# Altium project Main_Board_Diseño.PrjPcb (part 1 of 3)
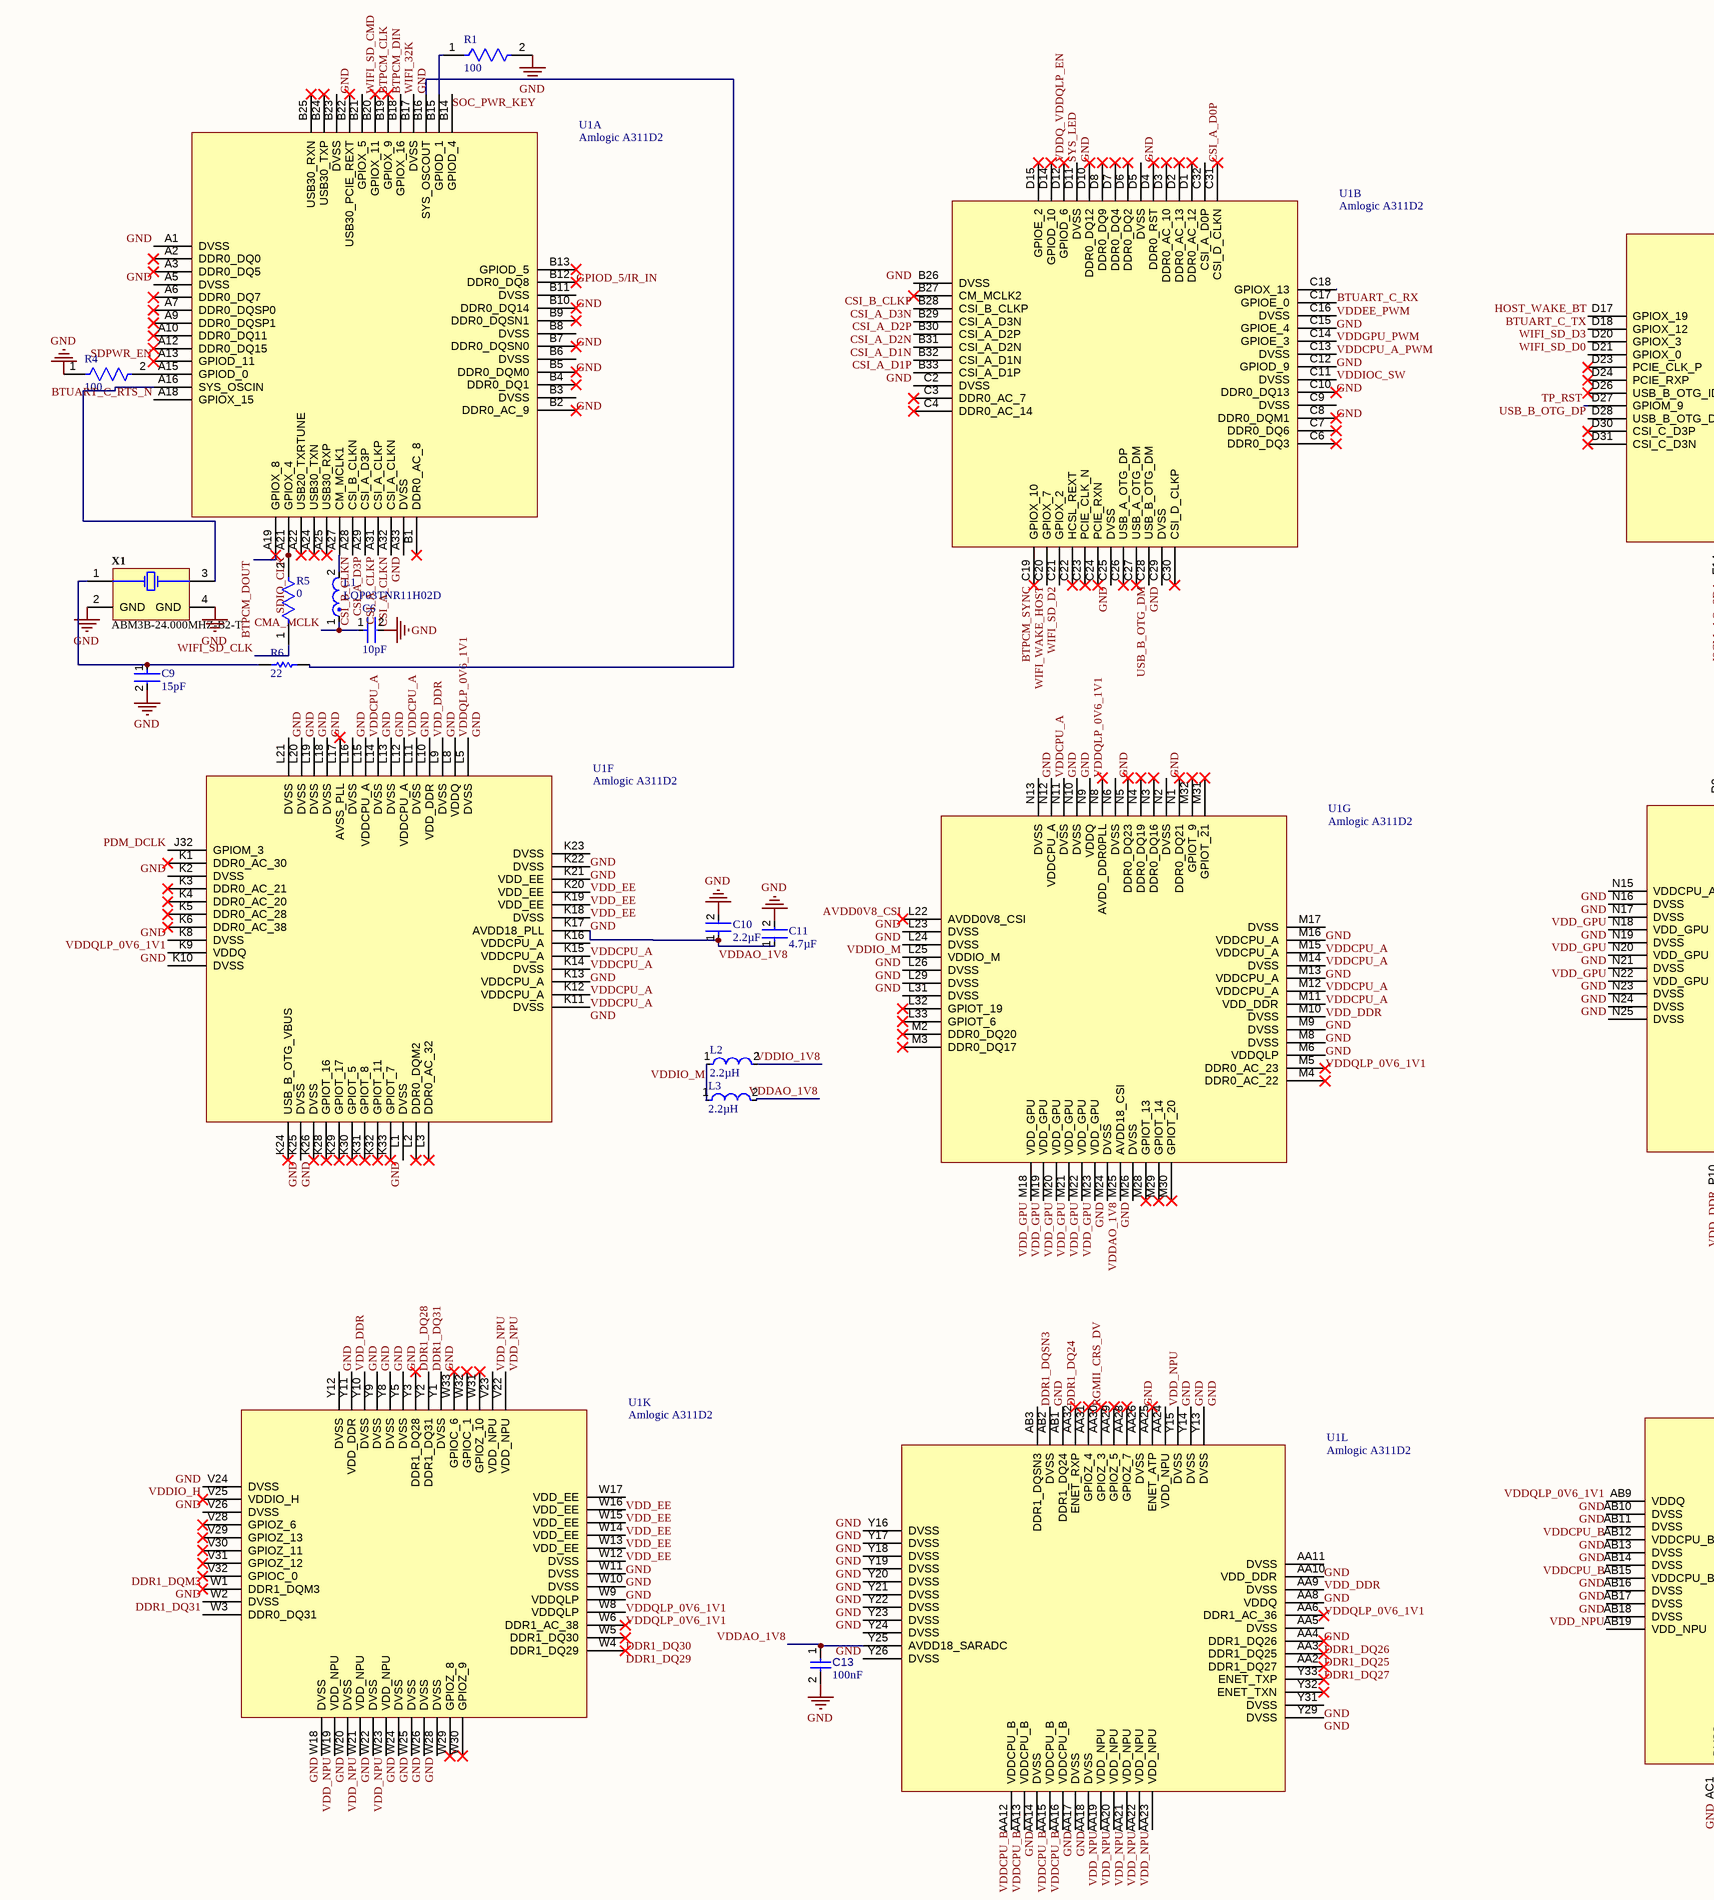
[diagram p0: Main_Board.SchDoc, top left]
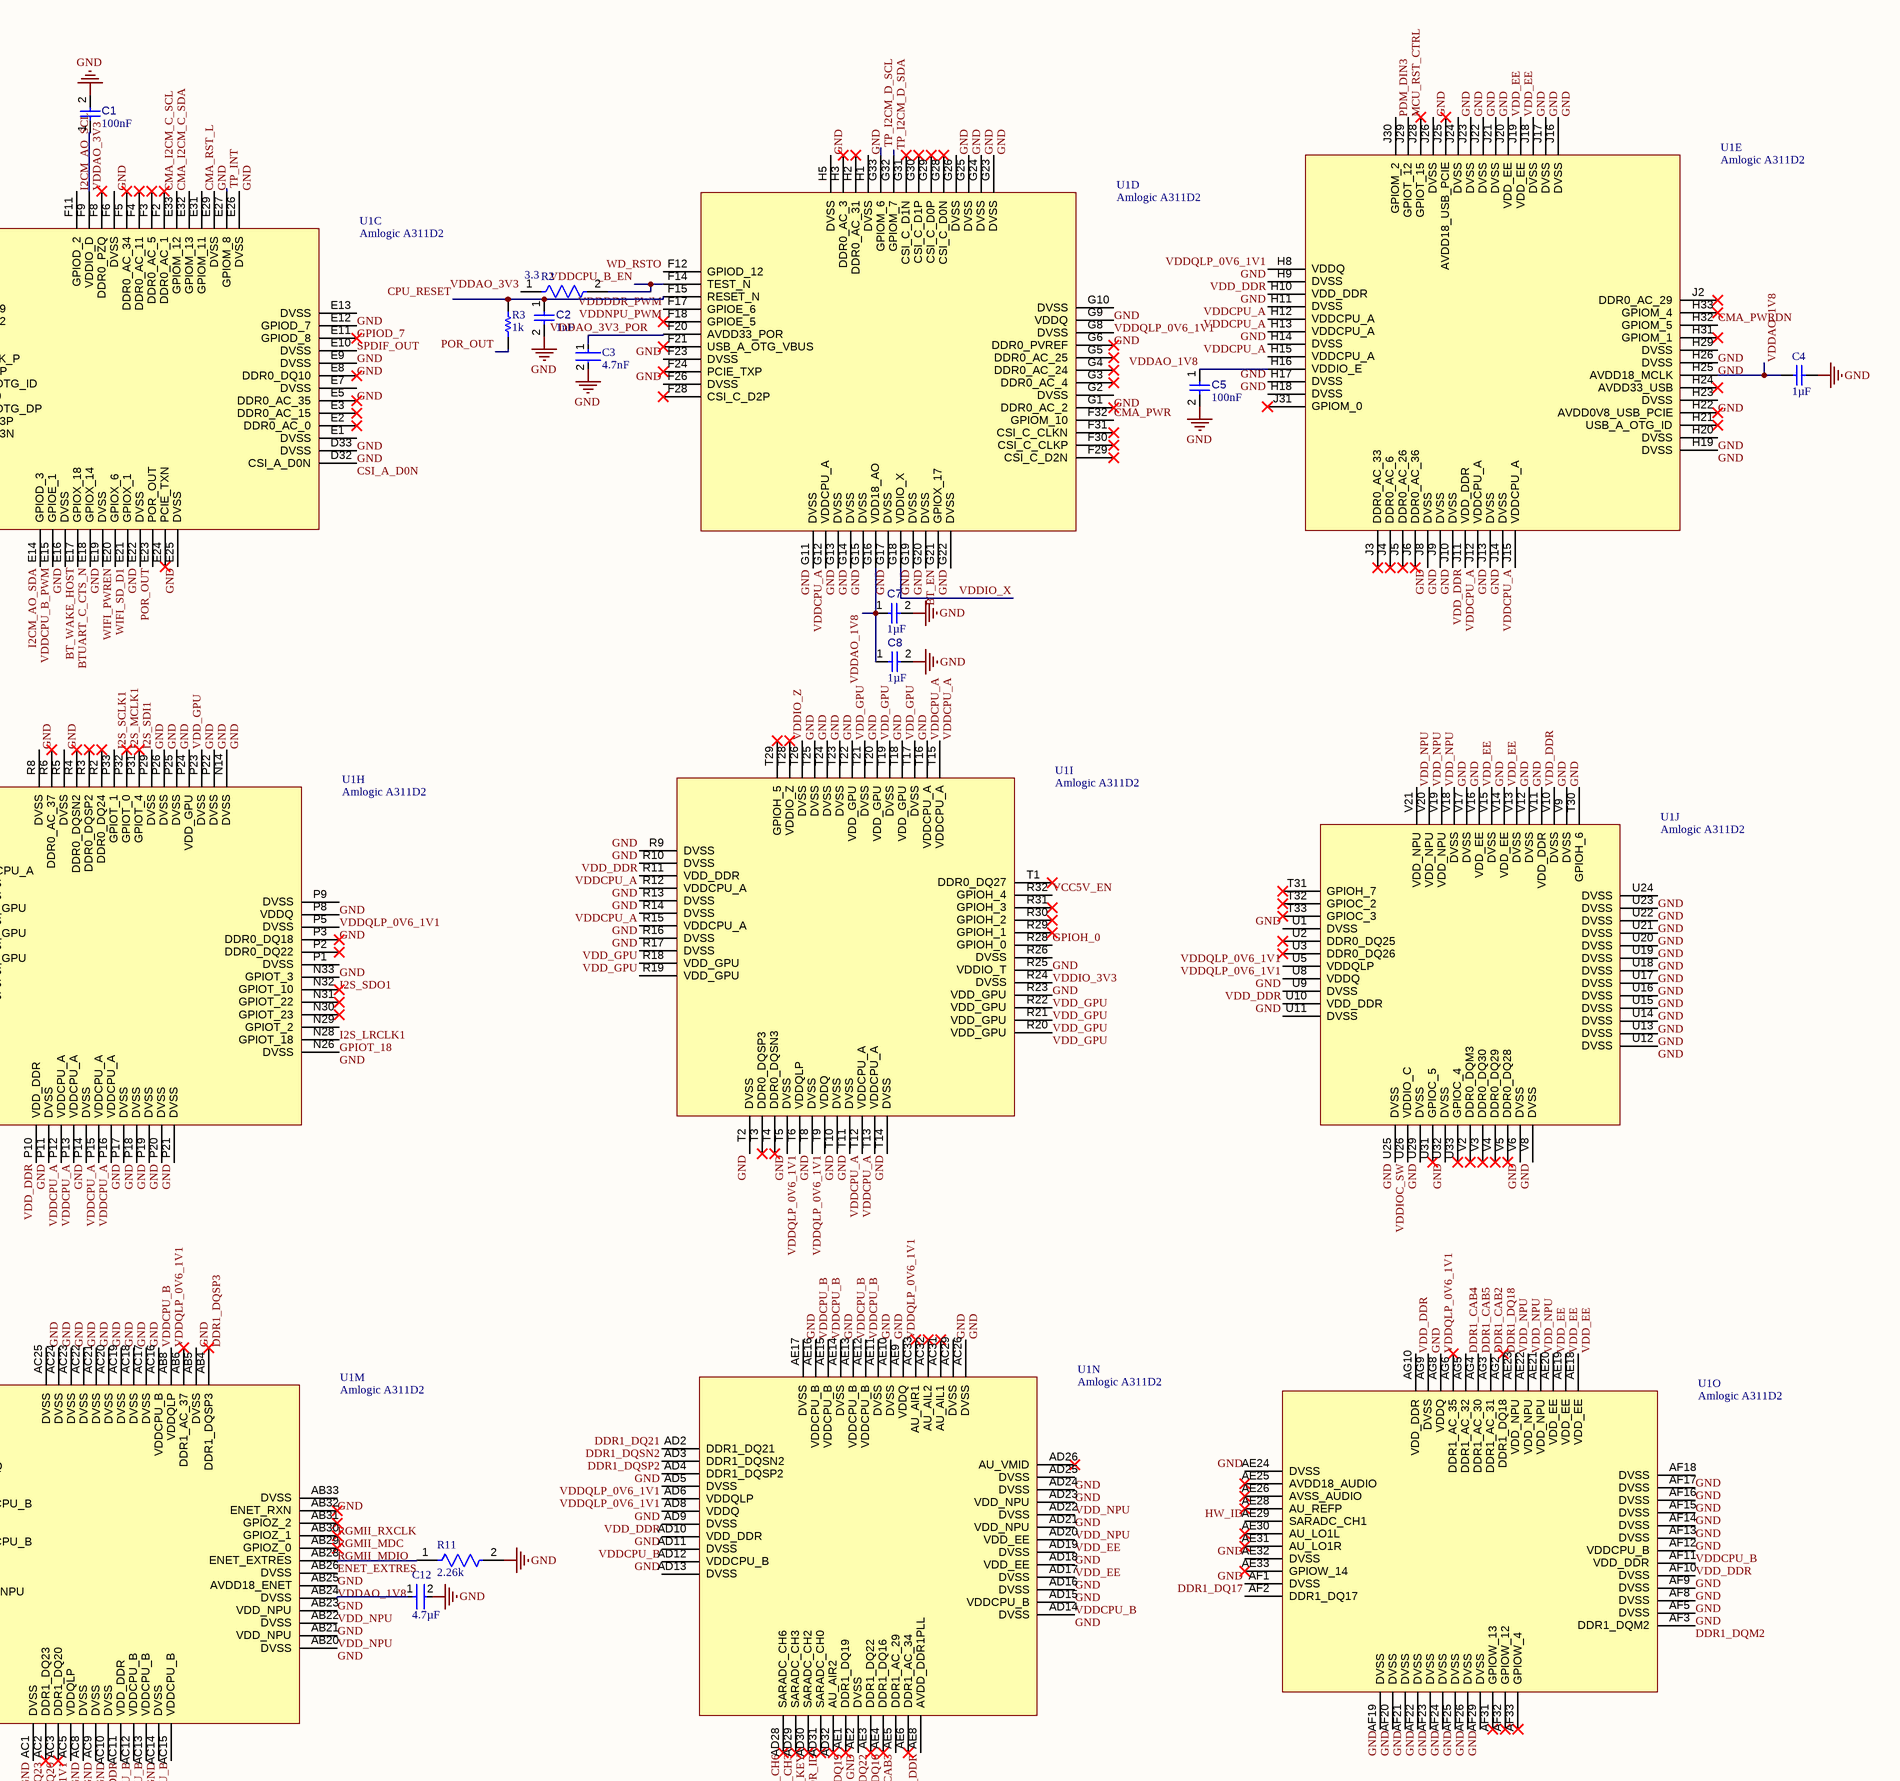
[diagram p1: Main_Board.SchDoc, top right]
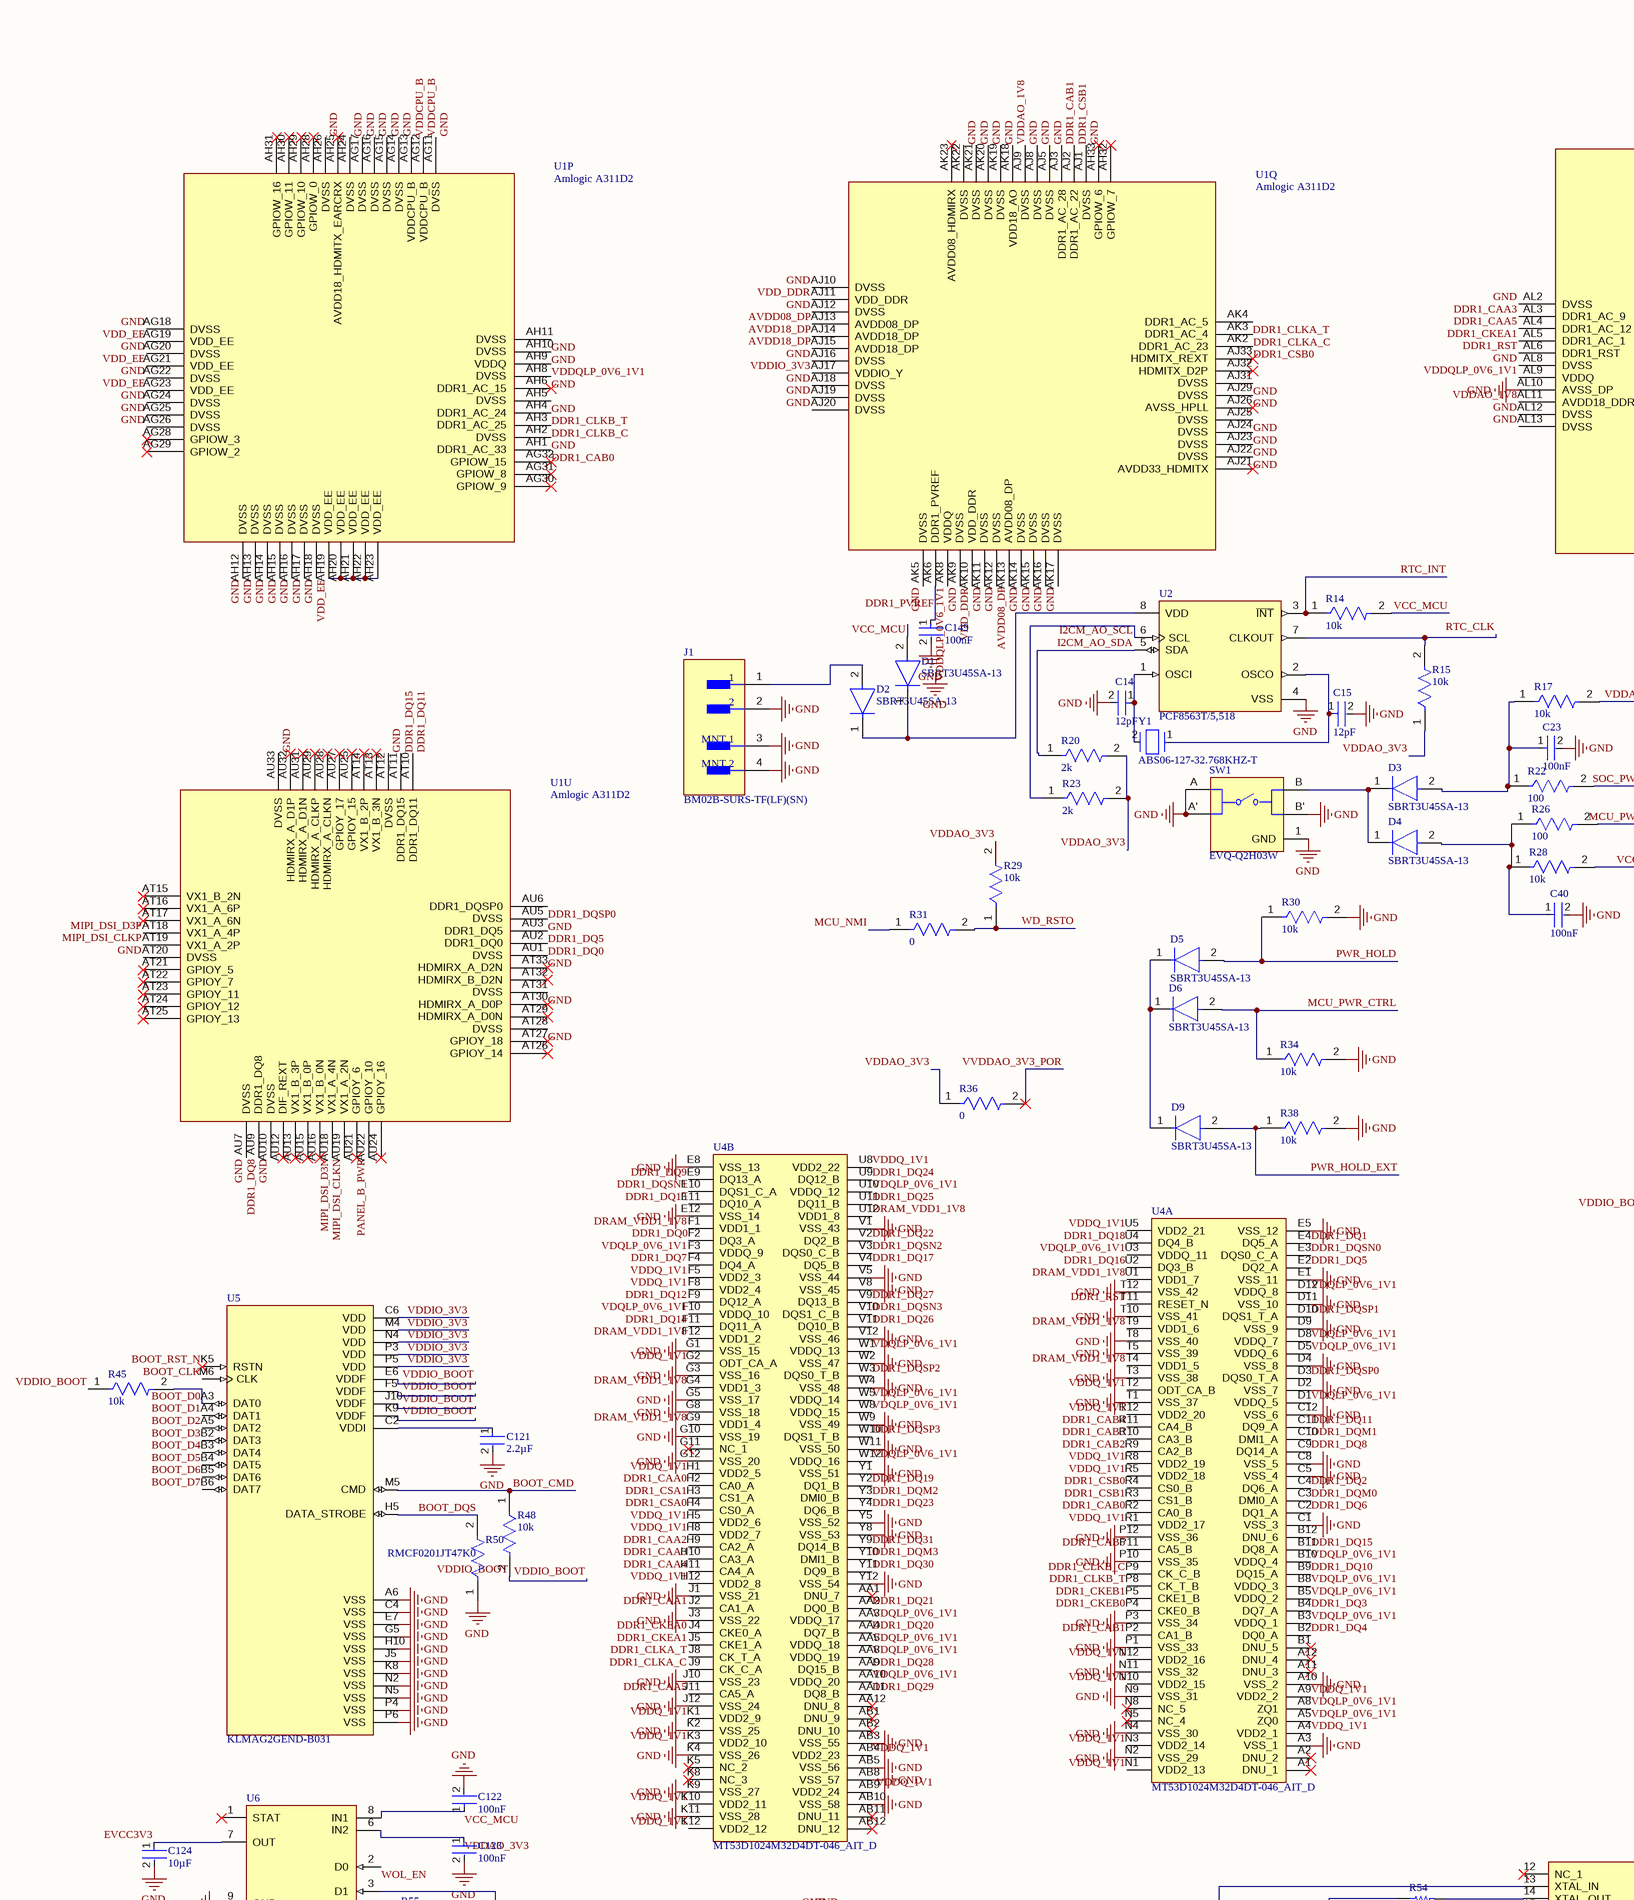
[diagram p2: Main_Board.SchDoc, centre left]
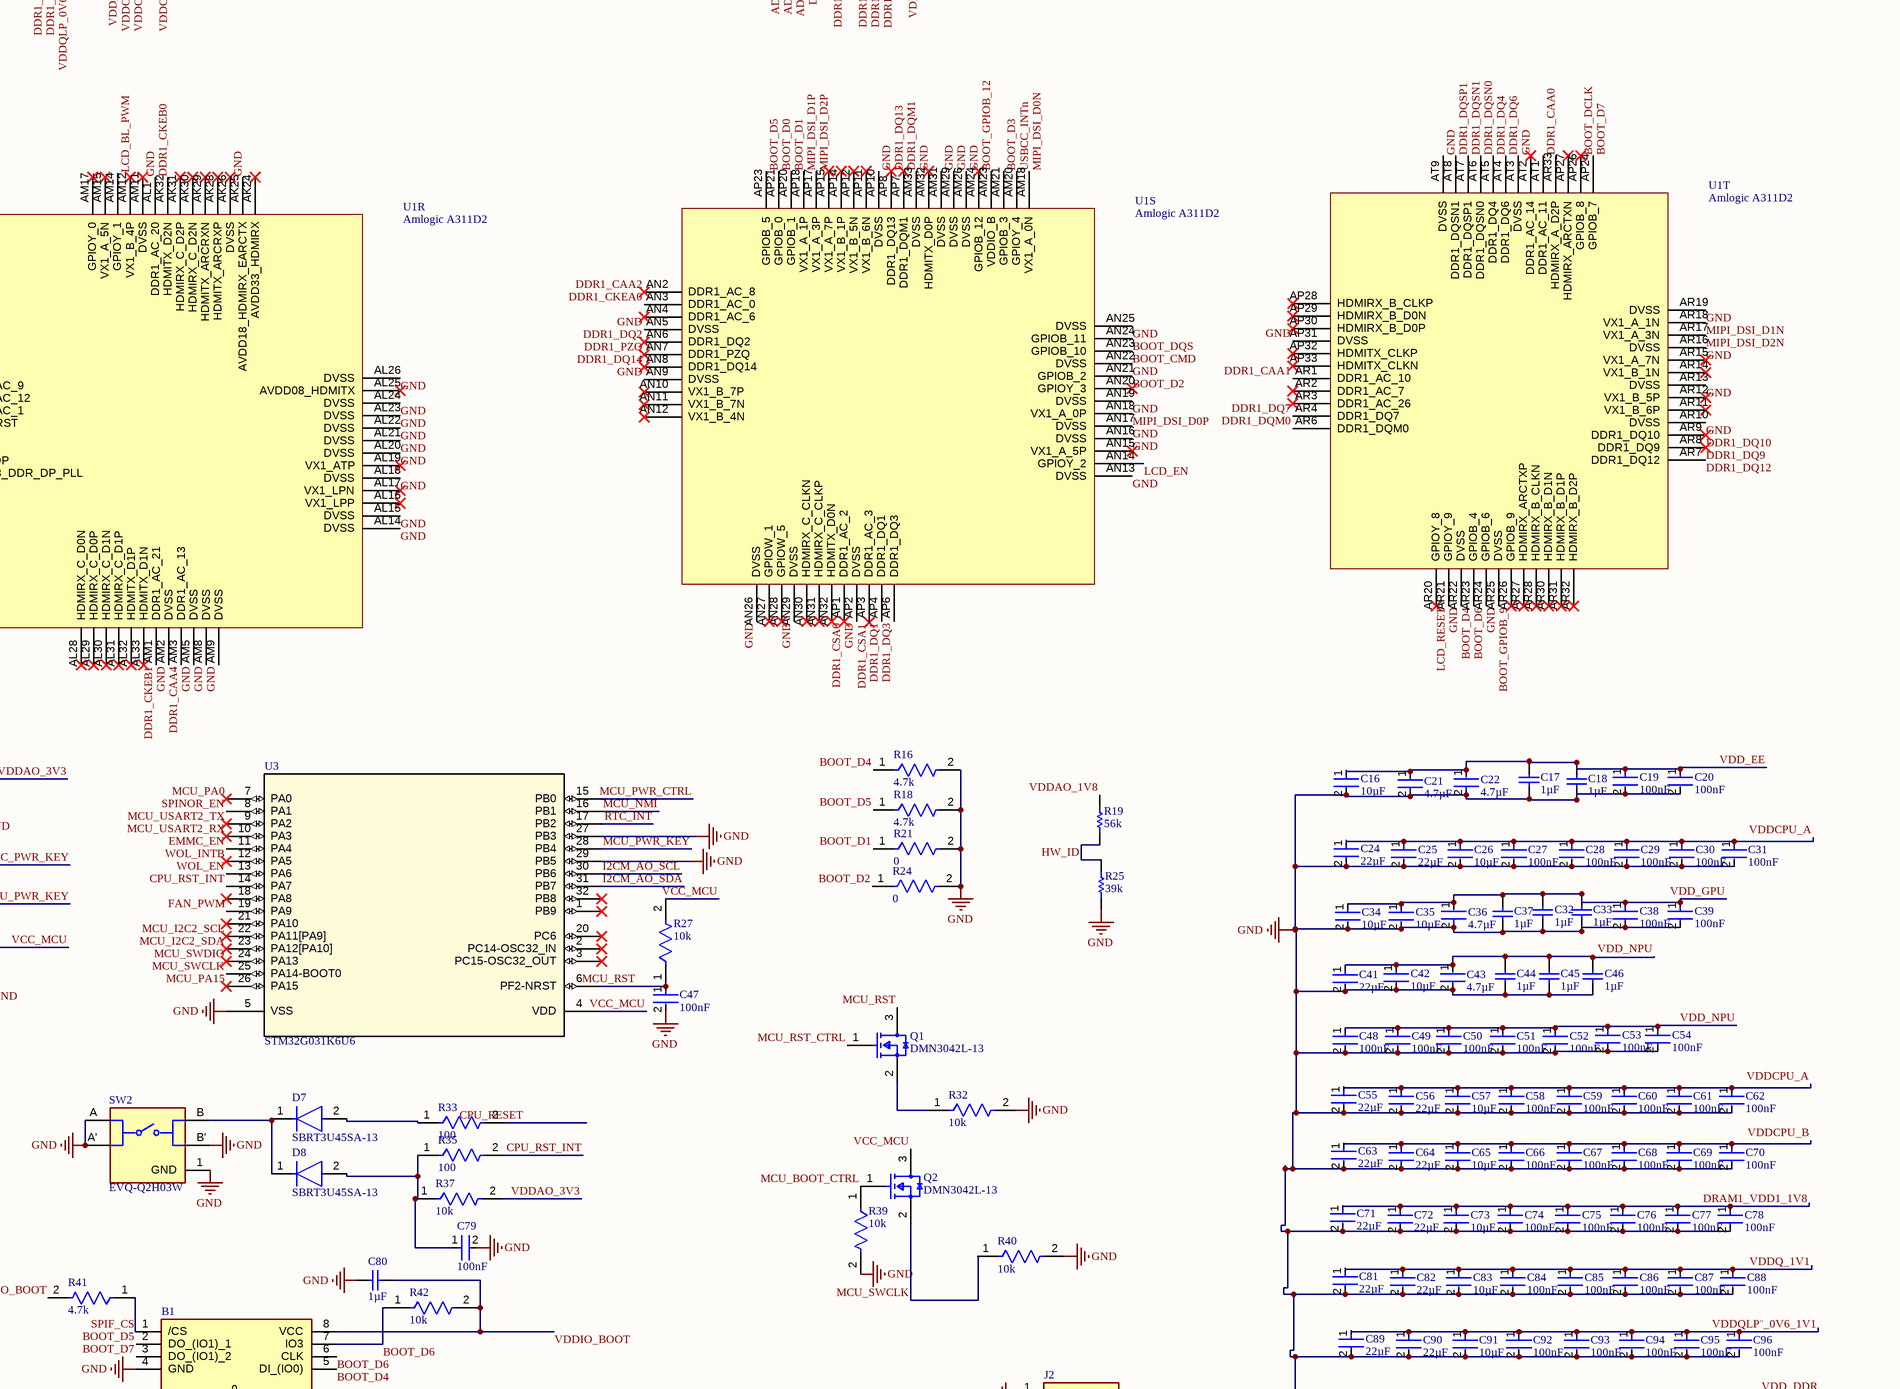
[diagram p3: Main_Board.SchDoc, centre right]
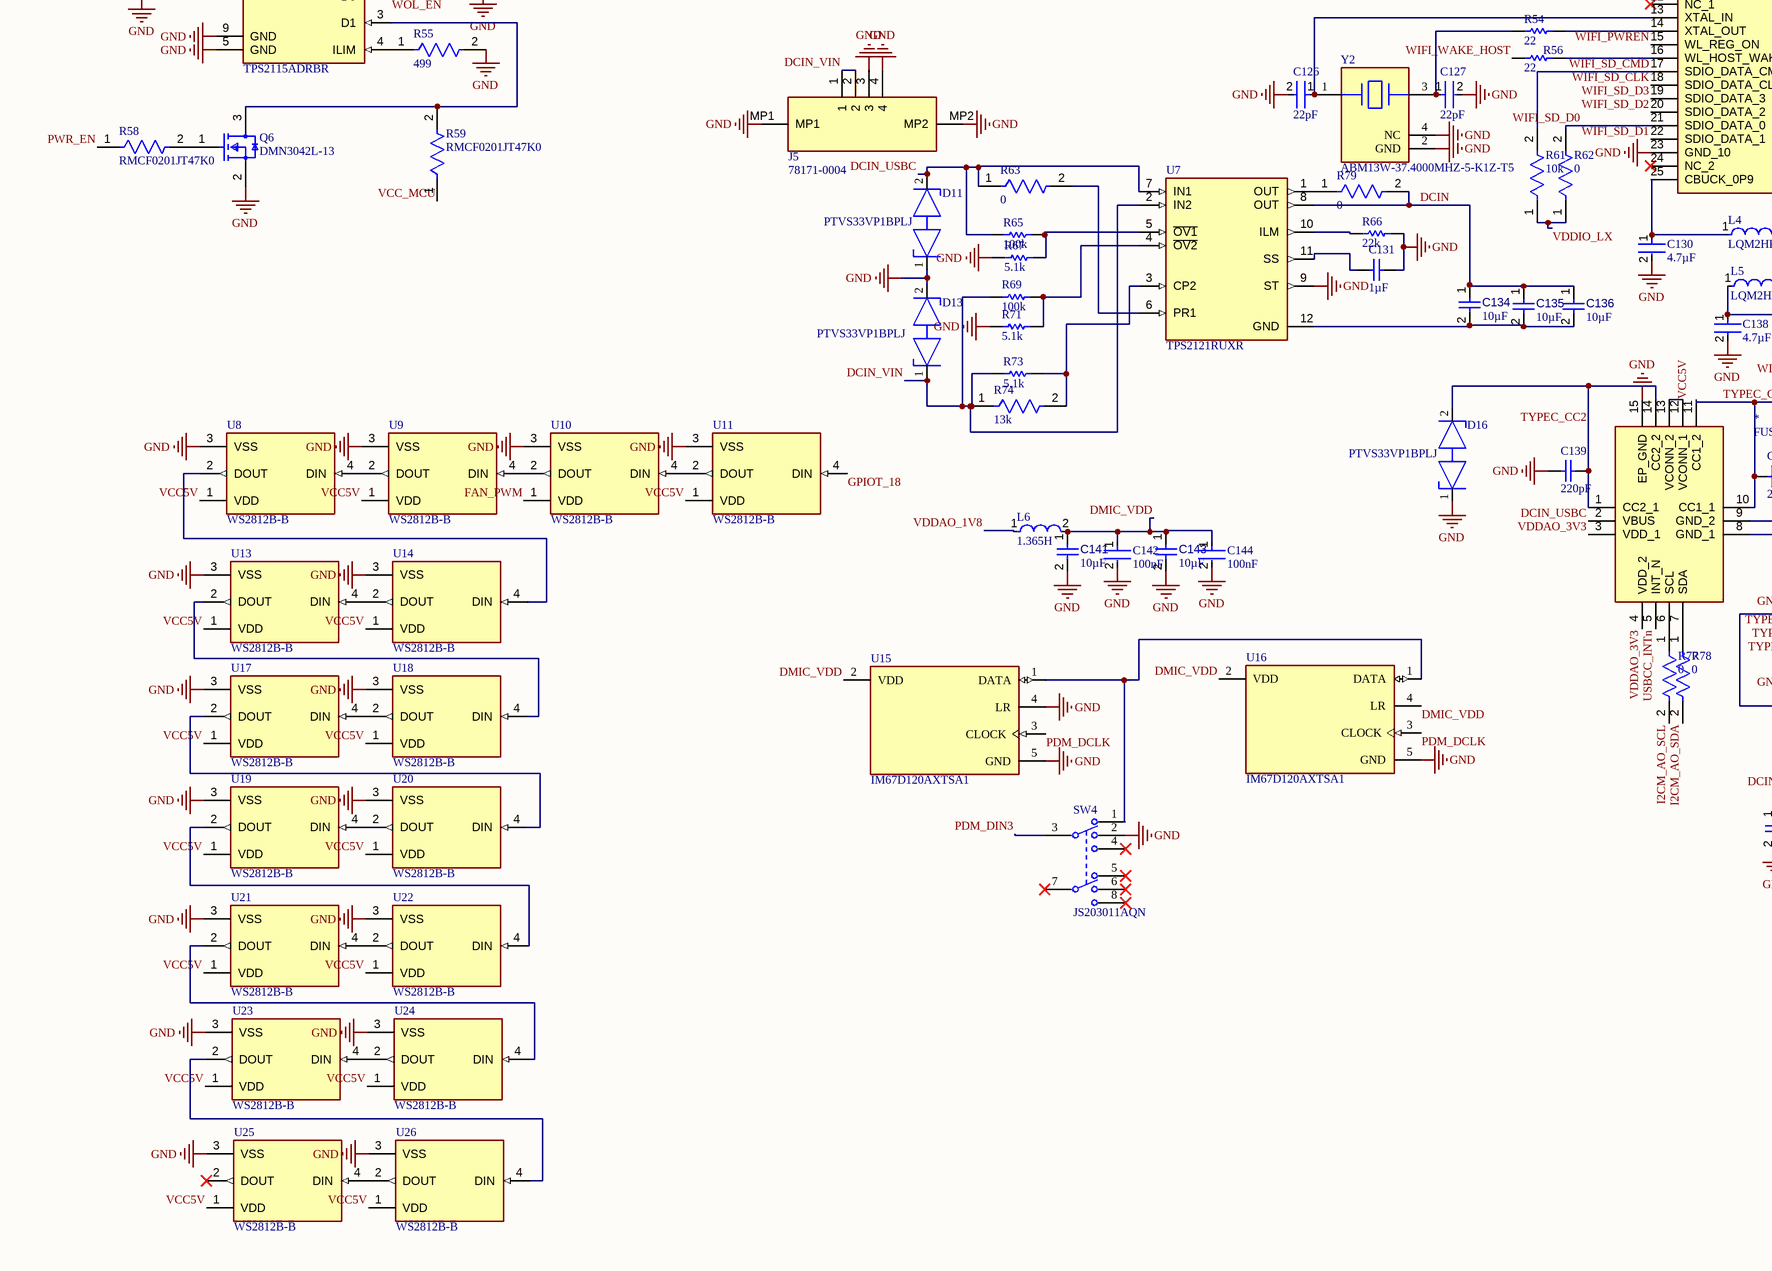
[diagram p4: Main_Board.SchDoc, bottom left]
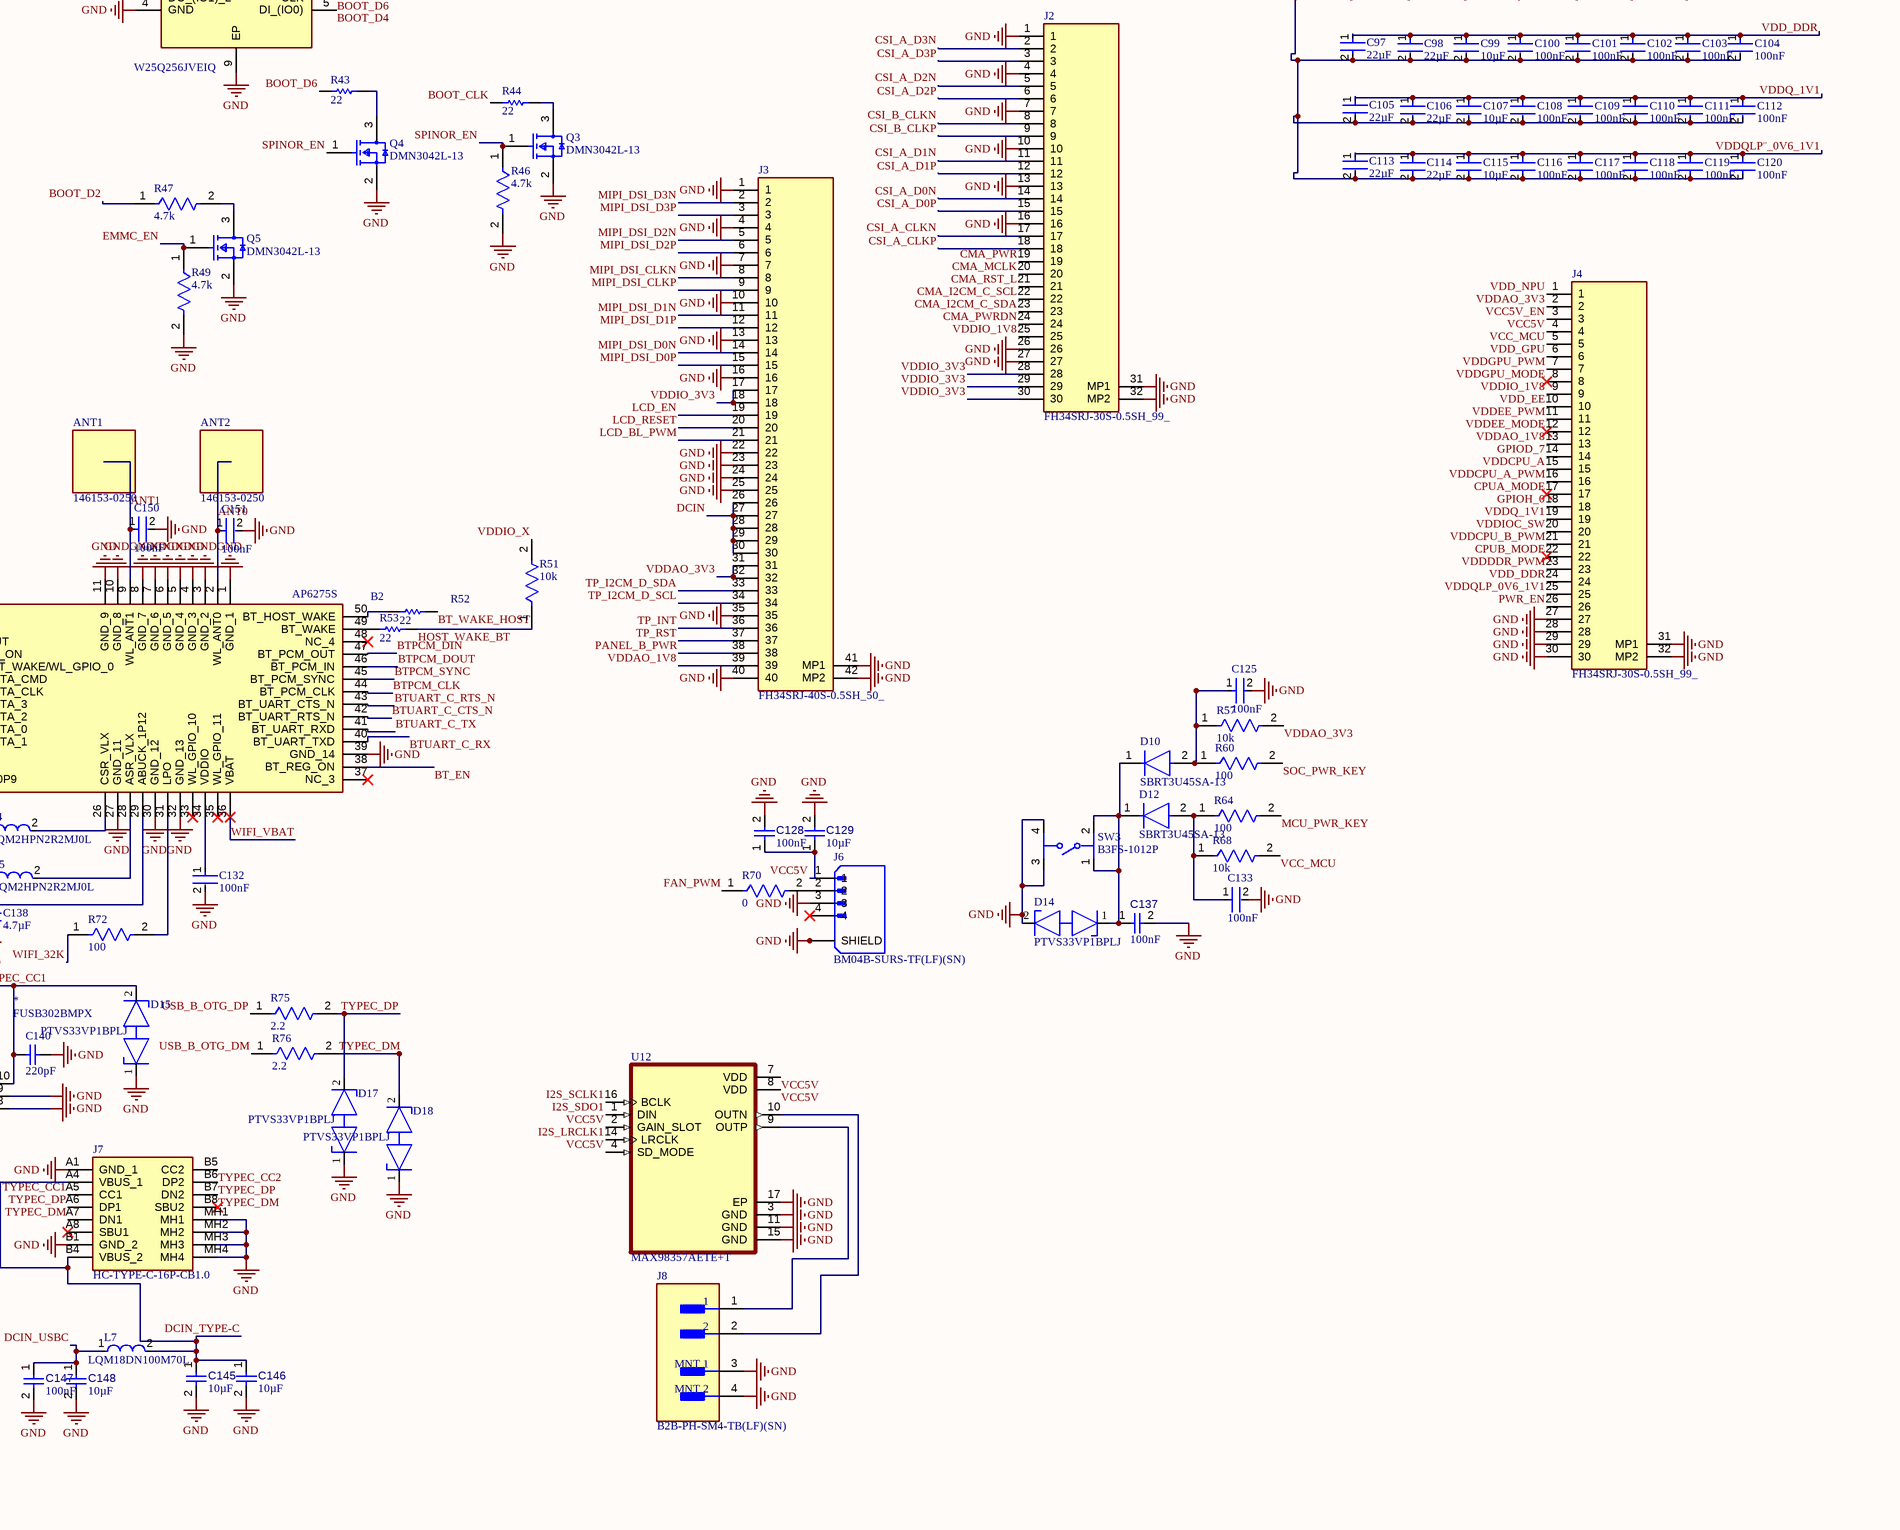
[diagram p5: Main_Board.SchDoc, bottom right]
1 sheet, 301 parts. Net scope: global (net labels, ports and power ports of the same name join across sheets).
Board file: Main_Board.PcbDoc

## Sheet Main_Board.SchDoc
size 711 x 1016 mm; SheetNumber: 1; SheetTotal: 1; SPICEModelCacheEOEZASWN: <root> / <DocumentId>EOEZASWN</DocumentId> / <CacheFrame Number="0"> / <Model Name="jmk105bbj475_vhf" Kind="CKT"> / <Text>* JMK105BBJ475_VHF     SPICE MODEL  ( General Type ) / *-------------------------------------------------------------------------------------------------------- / * Model Generated by TAIYO YUDEN Corporation (http://www.ty-top.com) / * Version 1.0 / * TAIYO YUDEN Control No. 181120 / * Copyright(c) 2013 TAIYO YUDEN CO.,LTD. All Rights Reserved. / *-------------------------------------------------------------------------------------------------------- / * / * Products Name : Multilayer Ceramic Capacitors / * / * Characteristics : / *     Capacitance : 4.7 uF , Rated Voltage : 6.3V , TCC : X5R / *     Case Size : 1.0 x 0.5 / 0.039 x 0.02 [mm/inch] , Thickness : 0.5 / 0.02 [mm/inch] / *     (Conditions: Temperature = 25 degC , DC Bias Current/Voltage = 0A / 0V) / * / * Frequency Range : 40Hz - 3GHz / * / * External Node Assignments : / * / *  1  o---| |---o  2 / * / *-------------------------------------------------------------------------------------------------------- / .SubCkt JMK105BBJ475_VHF 1 2 / **************************** / C0 1 110 3.7607u / Cm 1 101 0.44413u / C1 101 102 0.45311u / Rc1 101 102 658.52 / C2 102 103 0.19984u / Rc2 102 103 96.488 / C3 103 110 0.13246u / Rc3 103 110 6.3283 / C2m 1 301 0.90098u / C21 301 302 1.3593u / Rc21 301 302 3.1543k / C22 302 303 2.807u / Rc22 302 303 1.0655k / C23 303 304 2.6684u / Rc23 303 304 579.73 / C24 304 305 1.1696u / Rc24 304 305 74.614 / C25 305 306 0.96687u / Rc25 305 306 75.116 / C26 306 307 0.77974u / Rc26 306 307 32.88 / C27 307 308 0.27349u / Rc27 307 308 11.738 / C28 308 309 0.46979u / Rc28 308 309 5.6895 / C29 309 110 0.019038u / Rc29 309 110 3.1693 / Rp0 1 110 21.277Meg / L0 110 120 0.17881n / Lm 120 130 0.21157n / L1 120 121 0.072604n / RL1 121 130 1.3433 / L2 120 122 0.15643n / RL2 122 130 0.26647 / L3 120 123 0.36371n / RL3 123 130 0.23442 / CR 120 124 0.46327u / LR 124 125 0.50906n / RR 125 130 44.452m / CL 130 140 2.5192p / LL 130 140 0.13048n / RL 130 140 112.14 / Rs 140 2 3.0348m / **************************** / .ends JMK105BBJ475_VHF</Text> / </Model> / </CacheFrame> / </root>

### Parts
*  FUSB302BMPX  [FUSB302BMPX-Footprint-1]
ANT1  146153-0250  [FP-146153-0250-MFG]
ANT2  146153-0250  [FP-146153-0250-MFG]
B1  W25Q256JVEIQ  [SON127P800X600X80-9N-D]
B2  AP6275S  [AP6275S]
C1  value 100nF  [CAPC0402(1005)60_L]  (hidden comment: Capacitor 100nF +/-20% 50V 0402)
C2  value 1nF  [CAPC0402(1005)33_L]  (hidden comment: Capacitor 1nF +/-20% 50V 0402)
C3  value 4.7nF  [FP-CC0201-BA-IPC_A]  (hidden comment: CC0201KRX5R6BB472)
C4  value 1µF  [CAPC0603X33X15LL03T05]  (hidden comment: 0201ZD105MAT2A)
C5  value 100nF  [CAPC0402(1005)60_L]  (hidden comment: Capacitor 100nF +/-20% 10V 0402)
C6  value 10pF  [FP-GRM033-0_03-MFG]  (hidden comment: GRM0335C1H100FA01D)
C7  value 1µF  [CAPC0402(1005)60_L]  (hidden comment: Capacitor 1µF +/-20% 10V 0402)
C8  value 1µF  [CAPC0402(1005)60_L]  (hidden comment: Capacitor 1µF +/-20% 10V 0402)
C9  value 15pF  [FP-C0201-AB-IPC_A]  (hidden comment: C0201C150J3GACTU)
C10  value 2.2µF  [FP-CC0201-BA-IPC_A]  (hidden comment: CC0201MRX5R6BB225)
C11  value 4.7µF  [FP-GRM035-0_09-IPC_B]  (hidden comment: GRM035R60J475ME15J)
C12  value 4.7µF  [FP-GRM035-0_09-IPC_B]  (hidden comment: GRM035R60J475ME15J)
C13  value 100nF  [CAPC0402(1005)60_L]  (hidden comment: Capacitor 100nF +/-20% 10V 0402)
C14  value 12pF  [FP-GRM033-0_03-MFG]  (hidden comment: GRM0335C1H120FA01D)
C15  value 12pF  [FP-GRM033-0_03-MFG]  (hidden comment: GRM0335C1H120FA01D)
C16  value 10µF  [FP-GRM155-0_2-0_1-IPC_C]  (hidden comment: GRM155R60G106ME47D)
C17  value 1µF  [CAPC0603X33X15LL03T05]  (hidden comment: 0201ZD105MAT2A)
C18  value 1µF  [CAPC0603X33X15LL03T05]  (hidden comment: 0201ZD105MAT2A)
C19  value 100nF  [FP-CC0201-BA-IPC_A]  (hidden comment: CC0201KRX5R7BB104)
C20  value 100nF  [FP-CC0201-BA-IPC_A]  (hidden comment: CC0201KRX5R7BB104)
C21  value 4.7µF  [FP-0402-L_1_0_0_15-W_0_5-IPC_B]  (hidden comment: JMK105BBJ475MVHF)
C22  value 4.7µF  [FP-0402-L_1_0_0_15-W_0_5-IPC_B]  (hidden comment: JMK105BBJ475MVHF)
C23  value 100nF  [FP-CC0201-BA-IPC_A]  (hidden comment: CC0201KRX5R7BB104)
C24  value 22µF  [FP-GRM186-0_2-IPC_A]  (hidden comment: GRM186R60J226ME15D)
C25  value 22µF  [FP-GRM186-0_2-IPC_A]  (hidden comment: GRM186R60J226ME15D)
C26  value 10µF  [FP-GRM155-0_2-0_1-IPC_C]  (hidden comment: GRM155R60G106ME47D)
C27  value 100nF  [FP-CC0201-BA-IPC_A]  (hidden comment: CC0201KRX5R7BB104)
C28  value 100nF  [FP-CC0201-BA-IPC_A]  (hidden comment: CC0201KRX5R7BB104)
C29  value 100nF  [FP-CC0201-BA-IPC_A]  (hidden comment: CC0201KRX5R7BB104)
C30  value 100nF  [FP-CC0201-BA-IPC_A]  (hidden comment: CC0201KRX5R7BB104)
C31  value 100nF  [FP-CC0201-BA-IPC_A]  (hidden comment: CC0201KRX5R7BB104)
C32  value 1µF  [CAPC0603X33X15LL03T05]  (hidden comment: 0201ZD105MAT2A)
C33  value 1µF  [CAPC0603X33X15LL03T05]  (hidden comment: 0201ZD105MAT2A)
C34  value 10µF  [FP-GRM155-0_2-0_1-IPC_C]  (hidden comment: GRM155R60G106ME47D)
C35  value 10µF  [FP-GRM155-0_2-0_1-IPC_C]  (hidden comment: GRM155R60G106ME47D)
C36  value 4.7µF  [FP-0402-L_1_0_0_15-W_0_5-IPC_B]  (hidden comment: JMK105BBJ475MVHF)
C37  value 1µF  [CAPC0603X33X15LL03T05]  (hidden comment: 0201ZD105MAT2A)
C38  value 100nF  [FP-CC0201-BA-IPC_A]  (hidden comment: CC0201KRX5R7BB104)
C39  value 100nF  [FP-CC0201-BA-IPC_A]  (hidden comment: CC0201KRX5R7BB104)
C40  value 100nF  [FP-CC0201-BA-IPC_A]  (hidden comment: CC0201KRX5R7BB104)
C41  value 22µF  [FP-GRM186-0_2-IPC_A]  (hidden comment: GRM186R60J226ME15D)
C42  value 10µF  [FP-GRM155-0_2-0_1-IPC_C]  (hidden comment: GRM155R60G106ME47D)
C43  value 4.7µF  [FP-0402-L_1_0_0_15-W_0_5-IPC_B]  (hidden comment: JMK105BBJ475MVHF)
C44  value 1µF  [CAPC0603X33X15LL03T05]  (hidden comment: 0201ZD105MAT2A)
C45  value 1µF  [CAPC0603X33X15LL03T05]  (hidden comment: 0201ZD105MAT2A)
C46  value 1µF  [CAPC0603X33X15LL03T05]  (hidden comment: 0201ZD105MAT2A)
C47  value 100nF  [FP-CC0201-BA-IPC_A]  (hidden comment: CC0201KRX5R7BB104)
C48  value 100nF  [FP-CC0201-BA-IPC_A]  (hidden comment: CC0201KRX5R7BB104)
C49  value 100nF  [FP-CC0201-BA-IPC_A]  (hidden comment: CC0201KRX5R7BB104)
C50  value 100nF  [FP-CC0201-BA-IPC_A]  (hidden comment: CC0201KRX5R7BB104)
C51  value 100nF  [FP-CC0201-BA-IPC_A]  (hidden comment: CC0201KRX5R7BB104)
C52  value 100nF  [FP-CC0201-BA-IPC_A]  (hidden comment: CC0201KRX5R7BB104)
C53  value 100nF  [FP-CC0201-BA-IPC_A]  (hidden comment: CC0201KRX5R7BB104)
C54  value 100nF  [FP-CC0201-BA-IPC_A]  (hidden comment: CC0201KRX5R7BB104)
C55  value 22µF  [FP-GRM186-0_2-IPC_A]  (hidden comment: GRM186R60J226ME15D)
C56  value 22µF  [FP-GRM186-0_2-IPC_A]  (hidden comment: GRM186R60J226ME15D)
C57  value 10µF  [FP-GRM155-0_2-0_1-IPC_C]  (hidden comment: GRM155R60G106ME47D)
C58  value 100nF  [FP-CC0201-BA-IPC_A]  (hidden comment: CC0201KRX5R7BB104)
C59  value 100nF  [FP-CC0201-BA-IPC_A]  (hidden comment: CC0201KRX5R7BB104)
C60  value 100nF  [FP-CC0201-BA-IPC_A]  (hidden comment: CC0201KRX5R7BB104)
C61  value 100nF  [FP-CC0201-BA-IPC_A]  (hidden comment: CC0201KRX5R7BB104)
C62  value 100nF  [FP-CC0201-BA-IPC_A]  (hidden comment: CC0201KRX5R7BB104)
C63  value 22µF  [FP-GRM186-0_2-IPC_A]  (hidden comment: GRM186R60J226ME15D)
C64  value 22µF  [FP-GRM186-0_2-IPC_A]  (hidden comment: GRM186R60J226ME15D)
C65  value 10µF  [FP-GRM155-0_2-0_1-IPC_C]  (hidden comment: GRM155R60G106ME47D)
C66  value 100nF  [FP-CC0201-BA-IPC_A]  (hidden comment: CC0201KRX5R7BB104)
C67  value 100nF  [FP-CC0201-BA-IPC_A]  (hidden comment: CC0201KRX5R7BB104)
C68  value 100nF  [FP-CC0201-BA-IPC_A]  (hidden comment: CC0201KRX5R7BB104)
C69  value 100nF  [FP-CC0201-BA-IPC_A]  (hidden comment: CC0201KRX5R7BB104)
C70  value 100nF  [FP-CC0201-BA-IPC_A]  (hidden comment: CC0201KRX5R7BB104)
C71  value 22µF  [FP-GRM186-0_2-IPC_A]  (hidden comment: GRM186R60J226ME15D)
C72  value 22µF  [FP-GRM186-0_2-IPC_A]  (hidden comment: GRM186R60J226ME15D)
C73  value 10µF  [FP-GRM155-0_2-0_1-IPC_C]  (hidden comment: GRM155R60G106ME47D)
C74  value 100nF  [FP-CC0201-BA-IPC_A]  (hidden comment: CC0201KRX5R7BB104)
C75  value 100nF  [FP-CC0201-BA-IPC_A]  (hidden comment: CC0201KRX5R7BB104)
C76  value 100nF  [FP-CC0201-BA-IPC_A]  (hidden comment: CC0201KRX5R7BB104)
C77  value 100nF  [FP-CC0201-BA-IPC_A]  (hidden comment: CC0201KRX5R7BB104)
C78  value 100nF  [FP-CC0201-BA-IPC_A]  (hidden comment: CC0201KRX5R7BB104)
C79  value 100nF  [FP-CC0201-BA-IPC_A]  (hidden comment: CC0201KRX5R7BB104)
C80  value 1µF  [CAPC0603X33X15LL03T05]  (hidden comment: 0201ZD105MAT2A)
C81  value 22µF  [FP-GRM186-0_2-IPC_A]  (hidden comment: GRM186R60J226ME15D)
C82  value 22µF  [FP-GRM186-0_2-IPC_A]  (hidden comment: GRM186R60J226ME15D)
C83  value 10µF  [FP-GRM155-0_2-0_1-IPC_C]  (hidden comment: GRM155R60G106ME47D)
C84  value 100nF  [FP-CC0201-BA-IPC_A]  (hidden comment: CC0201KRX5R7BB104)
C85  value 100nF  [FP-CC0201-BA-IPC_A]  (hidden comment: CC0201KRX5R7BB104)
C86  value 100nF  [FP-CC0201-BA-IPC_A]  (hidden comment: CC0201KRX5R7BB104)
C87  value 100nF  [FP-CC0201-BA-IPC_A]  (hidden comment: CC0201KRX5R7BB104)
C88  value 100nF  [FP-CC0201-BA-IPC_A]  (hidden comment: CC0201KRX5R7BB104)
C89  value 22µF  [FP-GRM186-0_2-IPC_A]  (hidden comment: GRM186R60J226ME15D)
C90  value 22µF  [FP-GRM186-0_2-IPC_A]  (hidden comment: GRM186R60J226ME15D)
C91  value 10µF  [FP-GRM155-0_2-0_1-IPC_C]  (hidden comment: GRM155R60G106ME47D)
C92  value 100nF  [FP-CC0201-BA-IPC_A]  (hidden comment: CC0201KRX5R7BB104)
C93  value 100nF  [FP-CC0201-BA-IPC_A]  (hidden comment: CC0201KRX5R7BB104)
C94  value 100nF  [FP-CC0201-BA-IPC_A]  (hidden comment: CC0201KRX5R7BB104)
C95  value 100nF  [FP-CC0201-BA-IPC_A]  (hidden comment: CC0201KRX5R7BB104)
C96  value 100nF  [FP-CC0201-BA-IPC_A]  (hidden comment: CC0201KRX5R7BB104)
C97  value 22µF  [FP-GRM186-0_2-IPC_A]  (hidden comment: GRM186R60J226ME15D)
C98  value 22µF  [FP-GRM186-0_2-IPC_A]  (hidden comment: GRM186R60J226ME15D)
C99  value 10µF  [FP-GRM155-0_2-0_1-IPC_C]  (hidden comment: GRM155R60G106ME47D)
C100  value 100nF  [FP-CC0201-BA-IPC_A]  (hidden comment: CC0201KRX5R7BB104)
C101  value 100nF  [FP-CC0201-BA-IPC_A]  (hidden comment: CC0201KRX5R7BB104)
C102  value 100nF  [FP-CC0201-BA-IPC_A]  (hidden comment: CC0201KRX5R7BB104)
C103  value 100nF  [FP-CC0201-BA-IPC_A]  (hidden comment: CC0201KRX5R7BB104)
C104  value 100nF  [FP-CC0201-BA-IPC_A]  (hidden comment: CC0201KRX5R7BB104)
C105  value 22µF  [FP-GRM186-0_2-IPC_A]  (hidden comment: GRM186R60J226ME15D)
C106  value 22µF  [FP-GRM186-0_2-IPC_A]  (hidden comment: GRM186R60J226ME15D)
C107  value 10µF  [FP-GRM155-0_2-0_1-IPC_C]  (hidden comment: GRM155R60G106ME47D)
C108  value 100nF  [FP-CC0201-BA-IPC_A]  (hidden comment: CC0201KRX5R7BB104)
C109  value 100nF  [FP-CC0201-BA-IPC_A]  (hidden comment: CC0201KRX5R7BB104)
C110  value 100nF  [FP-CC0201-BA-IPC_A]  (hidden comment: CC0201KRX5R7BB104)
C111  value 100nF  [FP-CC0201-BA-IPC_A]  (hidden comment: CC0201KRX5R7BB104)
C112  value 100nF  [FP-CC0201-BA-IPC_A]  (hidden comment: CC0201KRX5R7BB104)
C113  value 22µF  [FP-GRM186-0_2-IPC_A]  (hidden comment: GRM186R60J226ME15D)
C114  value 22µF  [FP-GRM186-0_2-IPC_A]  (hidden comment: GRM186R60J226ME15D)
C115  value 10µF  [FP-GRM155-0_2-0_1-IPC_C]  (hidden comment: GRM155R60G106ME47D)
C116  value 100nF  [FP-CC0201-BA-IPC_A]  (hidden comment: CC0201KRX5R7BB104)
C117  value 100nF  [FP-CC0201-BA-IPC_A]  (hidden comment: CC0201KRX5R7BB104)
C118  value 100nF  [FP-CC0201-BA-IPC_A]  (hidden comment: CC0201KRX5R7BB104)
C119  value 100nF  [FP-CC0201-BA-IPC_A]  (hidden comment: CC0201KRX5R7BB104)
C120  value 100nF  [FP-CC0201-BA-IPC_A]  (hidden comment: CC0201KRX5R7BB104)
C121  value 2.2µF  [FP-CC0201-BA-IPC_A]  (hidden comment: CC0201MRX5R6BB225)
C122  value 100nF  [FP-CC0201-BA-IPC_A]  (hidden comment: CC0201KRX5R7BB104)
C123  value 100nF  [FP-CC0201-BA-IPC_A]  (hidden comment: CC0201KRX5R7BB104)
C124  value 10µF  [FP-GRM155-0_2-0_1-IPC_C]  (hidden comment: GRM155R60G106ME47D)
C125  value 100nF  [FP-CC0201-BA-IPC_A]  (hidden comment: CC0201KRX5R7BB104)
C126  value 22pF  [FP-GRM033-0_03-MFG]  (hidden comment: GRM0335C1E220FA01D)
C127  value 22pF  [FP-GRM033-0_03-MFG]  (hidden comment: GRM0335C1E220FA01D)
C128  value 100nF  [CAPC0402(1005)60_L]  (hidden comment: Capacitor 100nF +/-20% 50V 0402)
C129  value 10µF  [CAPC0402(1005)60_L]  (hidden comment: Capacitor 10µF +/-40% 6.3V 0402)
C130  value 4.7µF  [FP-GRM035-0_09-IPC_B]  (hidden comment: GRM035R60J475ME15J)
C131  value 1µF  [CAPC0603X33X15LL03T05]  (hidden comment: 0201ZD105MAT2A)
C132  value 100nF  [FP-CC0201-BA-IPC_A]  (hidden comment: CC0201KRX5R7BB104)
C133  value 100nF  [FP-CC0201-BA-IPC_A]  (hidden comment: CC0201KRX5R7BB104)
C134  value 10µF  [CAPC0603(1608)100_L]  (hidden comment: Capacitor 10µF +/-20% 10V 0603)
C135  value 10µF  [CAPC0603(1608)100_L]  (hidden comment: Capacitor 10µF +/-20% 10V 0603)
C136  value 10µF  [CAPC0603(1608)100_L]  (hidden comment: Capacitor 10µF +/-20% 10V 0603)
C137  value 100nF  [CAPC0402(1005)60_L]  (hidden comment: Capacitor 100nF +/-20% 50V 0402)
C138  value 4.7µF  [FP-GRM035-0_09-IPC_B]  (hidden comment: GRM035R60J475ME15J)
C139  value 220pF  [CAPC0603X33X15LL03T05]  (hidden comment: 0201YC221KAT2A)
C140  value 220pF  [CAPC0603X33X15LL03T05]  (hidden comment: 0201YC221KAT2A)
C141  value 10µF  [CAPC0402(1005)60_L]  (hidden comment: Capacitor 10µF +/-40% 6.3V 0402)
C142  value 100nF  [FP-CC0201-BA-IPC_A]  (hidden comment: CC0201KRX5R7BB104)
C143  value 10µF  [CAPC0402(1005)60_L]  (hidden comment: Capacitor 10µF +/-40% 6.3V 0402)
C144  value 100nF  [FP-CC0201-BA-IPC_A]  (hidden comment: CC0201KRX5R7BB104)
C145  value 10µF  [CAPC0603(1608)100_L]  (hidden comment: Capacitor 10µF +/-20% 10V 0603)
C146  value 10µF  [CAPC0603(1608)100_L]  (hidden comment: Capacitor 10µF +/-20% 10V 0603)
C147  value 100nF  [CAPC1005X56X25LL10T15]  (hidden comment: Capacitor 0.1 uF +/- 5% 16 V 0402)
C148  value 10µF  [CAPC0603(1608)100_L]  (hidden comment: Capacitor 10µF +/-20% 10V 0603)
C149  value 100nF  [FP-CC0201-BA-IPC_A]  (hidden comment: CC0201KRX5R7BB104)
C150  value 100nF  [FP-CC0201-BA-IPC_A]  (hidden comment: CC0201KRX5R7BB104)
C151  value 100nF  [FP-CC0201-BA-IPC_A]  (hidden comment: CC0201KRX5R7BB104)
D1  SBRT3U45SA-13  [FP-SMA-MFG]
D2  SBRT3U45SA-13  [FP-SMA-MFG]
D3  SBRT3U45SA-13  [FP-SMA-MFG]
D4  SBRT3U45SA-13  [FP-SMA-MFG]
D5  SBRT3U45SA-13  [FP-SMA-MFG]
D6  SBRT3U45SA-13  [FP-SMA-MFG]
D7  SBRT3U45SA-13  [FP-SMA-MFG]
D8  SBRT3U45SA-13  [FP-SMA-MFG]
D9  SBRT3U45SA-13  [FP-SMA-MFG]
D10  SBRT3U45SA-13  [FP-SMA-MFG]
D11  PTVS33VP1BPLJ  [FP-SOD128FL-1-CA_MFG]
D12  SBRT3U45SA-13  [FP-SMA-MFG]
D13  PTVS33VP1BPLJ  [FP-SOD128FL-1-CA_MFG]
D14  PTVS33VP1BPLJ  [FP-SOD128FL-1-CA_MFG]
D15  PTVS33VP1BPLJ  [FP-SOD128FL-1-CA_MFG]
D16  PTVS33VP1BPLJ  [FP-SOD128FL-1-CA_MFG]
D17  PTVS33VP1BPLJ  [FP-SOD128FL-1-CA_MFG]
D18  PTVS33VP1BPLJ  [FP-SOD128FL-1-CA_MFG]
J1  BM02B-SURS-TF(LF)(SN)  [FP-BM02B-SURS-TF_LF_SN-MFG]
J2  FH34SRJ-30S-0.5SH_99_  [FH34SRJ30S05SH99]
J3  FH34SRJ-40S-0.5SH_50_  [FH34SRJ40S05SH50]
J4  FH34SRJ-30S-0.5SH_99_  [FH34SRJ30S05SH99]
J5  78171-0004  [781710004]
J6  BM04B-SURS-TF(LF)(SN)  [JST_BM04B-SURS-TF(LF)(SN)]
J7  HC-TYPE-C-16P-CB1.0  [HCTYPEC16PCB10]
J8  B2B-PH-SM4-TB(LF)(SN)  [FP-B2B-PH-SM4-TB_LF_SN-MFG]
L1  LQP03TNR11H02D  [FP-LQP03PN_02-MFG]
L2  value 2.2µH  [FP-LQM2HPN_J0-IPC_A]  (hidden comment: LQM2HPN2R2MJ0L)
L3  value 2.2µH  [FP-LQM2HPN_J0-IPC_A]  (hidden comment: LQM2HPN2R2MJ0L)
L4  LQM2HPN2R2MJ0L  [FP-LQM2HPN_J0-IPC_A]
L5  LQM2HPN2R2MJ0L  [FP-LQM2HPN_J0-IPC_A]
L6  value 1.365H  [FP-LQM18DN_70-MFG]  (hidden comment: LQM18DN100M70L)
L7  LQM18DN100M70L  [FP-LQM18DN_70-IPC_B]
Q1  DMN3042L-13  [FP-SOT23-MFG]
Q2  DMN3042L-13  [FP-SOT23-MFG]
Q3  DMN3042L-13  [FP-SOT23-MFG]
Q4  DMN3042L-13  [FP-SOT23-MFG]
Q5  DMN3042L-13  [FP-SOT23-MFG]
Q6  DMN3042L-13  [FP-SOT23-MFG]
R1  value 100  [FP-RMCF0201-IPC_A]  (hidden comment: RMCF0201JT100R)
R2  value 3.3  [FP-RMCF0201-IPC_A]  (hidden comment: RMCF0201JT3R30)
R3  value 1k  [RESC0603X26X15NL03T05]  (hidden comment: MCRE000140)
R4  value 100  [FP-RMCF0201-IPC_A]  (hidden comment: RMCF0201JT100R)
R5  value 0  [FP-HCJ0201-IPC_C]  (hidden comment: HCJ0201ZT0R00)
R6  value 22  [RESC0603X28X15ML05T05]  (hidden comment: CRCW020122R0JNED)
R11  value 2.26k  [FP-ERJ1GN-IPC_B]  (hidden comment: ERJ-1GNF2261C)
R14  value 10k  [FP-RT0201-IPC_C]  (hidden comment: RT0201BRE0710KL)
R15  value 10k  [FP-RT0201-IPC_C]  (hidden comment: RT0201BRE0710KL)
R16  value 4.7k  [FP-RMCF0201-IPC_A]  (hidden comment: RMCF0201JT4K70)
R17  value 10k  [FP-RT0201-IPC_C]  (hidden comment: RT0201BRE0710KL)
R18  value 4.7k  [FP-RMCF0201-IPC_A]  (hidden comment: RMCF0201JT4K70)
R19  value 56k  [RESC0603X28X15ML05T05]  (hidden comment: CRCW020156K0JNED)
R20  value 2k  [FP-RMCF0201-IPC_A]  (hidden comment: RMCF0201JT2K00)
R21  value 0  [FP-HCJ0201-IPC_C]  (hidden comment: HCJ0201ZT0R00)
R22  value 100  [FP-RMCF0201-IPC_A]  (hidden comment: RMCF0201JT100R)
R23  value 2k  [FP-RMCF0201-IPC_A]  (hidden comment: RMCF0201JT2K00)
R24  value 0  [FP-HCJ0201-IPC_C]  (hidden comment: HCJ0201ZT0R00)
R25  value 39k  [RESC0603X28X15ML05T05]  (hidden comment: CRCW020139K0JNED)
R26  value 100  [FP-RMCF0201-IPC_A]  (hidden comment: RMCF0201JT100R)
R27  value 10k  [FP-RT0201-IPC_C]  (hidden comment: RT0201BRE0710KL)
R28  value 10k  [FP-RT0201-IPC_C]  (hidden comment: RT0201BRE0710KL)
R29  value 10k  [FP-RT0201-IPC_C]  (hidden comment: RT0201BRE0710KL)
R30  value 10k  [FP-RT0201-IPC_C]  (hidden comment: RT0201BRE0710KL)
R31  value 0  [FP-HCJ0201-IPC_C]  (hidden comment: HCJ0201ZT0R00)
R32  value 10k  [FP-RT0201-IPC_C]  (hidden comment: RT0201BRE0710KL)
R33  value 100  [FP-RMCF0201-IPC_A]  (hidden comment: RMCF0201JT100R)
R34  value 10k  [FP-RT0201-IPC_C]  (hidden comment: RT0201BRE0710KL)
R35  value 100  [FP-RMCF0201-IPC_A]  (hidden comment: RMCF0201JT100R)
R36  value 0  [FP-HCJ0201-IPC_C]  (hidden comment: HCJ0201ZT0R00)
R37  value 10k  [FP-RT0201-IPC_C]  (hidden comment: RT0201BRE0710KL)
R38  value 10k  [FP-RT0201-IPC_C]  (hidden comment: RT0201BRE0710KL)
R39  value 10k  [FP-RT0201-IPC_C]  (hidden comment: RT0201BRE0710KL)
R40  value 10k  [FP-RT0201-IPC_C]  (hidden comment: RT0201BRE0710KL)
R41  value 4.7k  [FP-RMCF0201-IPC_A]  (hidden comment: RMCF0201JT4K70)
R42  value 10k  [FP-RT0201-IPC_C]  (hidden comment: RT0201BRE0710KL)
R43  value 22  [RESC0603X28X15ML05T05]  (hidden comment: CRCW020122R0JNED)
R44  value 22  [RESC0603X28X15ML05T05]  (hidden comment: CRCW020122R0JNED)
R45  value 10k  [FP-RT0201-IPC_C]  (hidden comment: RT0201BRE0710KL)
R46  value 4.7k  [FP-RMCF0201-IPC_A]  (hidden comment: RMCF0201JT4K70)
R47  value 4.7k  [FP-RMCF0201-IPC_A]  (hidden comment: RMCF0201JT4K70)
R48  value 10k  [FP-RT0201-IPC_C]  (hidden comment: RT0201BRE0710KL)
R49  value 4.7k  [FP-RMCF0201-IPC_A]  (hidden comment: RMCF0201JT4K70)
R50  RMCF0201JT47K0  [FP-RMCF0201-IPC_A]
R51  value 10k  [FP-RT0201-IPC_C]  (hidden comment: RT0201BRE0710KL)
R52  value 22  [RESC0603X28X15ML05T05]  (hidden comment: CRCW020122R0JNED)
R53  value 22  [RESC0603X28X15ML05T05]  (hidden comment: CRCW020122R0JNED)
R54  value 22  [RESC0603X28X15ML05T05]  (hidden comment: CRCW020122R0JNED)
R55  value 499  [FP-AF0201-IPC_B]  (hidden comment: AF0201FR-07499RL)
R56  value 22  [RESC0603X28X15ML05T05]  (hidden comment: CRCW020122R0JNED)
R57  value 10k  [FP-RT0201-IPC_C]  (hidden comment: RT0201BRE0710KL)
R58  RMCF0201JT47K0  [FP-RMCF0201-IPC_A]
R59  RMCF0201JT47K0  [FP-RMCF0201-IPC_A]
R60  value 100  [FP-RMCF0201-IPC_A]  (hidden comment: RMCF0201JT100R)
R61  value 10k  [FP-RT0201-IPC_C]  (hidden comment: RT0201BRE0710KL)
R62  value 0  [FP-HCJ0201-IPC_C]  (hidden comment: HCJ0201ZT0R00)
R63  value 0  [FP-HCJ0201-IPC_C]  (hidden comment: HCJ0201ZT0R00)
R64  value 100  [FP-RMCF0201-IPC_A]  (hidden comment: RMCF0201JT100R)
R65  value 100k  [RESC0603X26X15NL03T05]  (hidden comment: CRG0201F100K)
R66  value 22k  [RESC0603X28X15ML05T05]  (hidden comment: CRCW020122K0JNED)
R67  value 5.1k  [RESC0603X28X15ML05T05]  (hidden comment: CRCW02015K10JNED)
R68  value 10k  [FP-RT0201-IPC_C]  (hidden comment: RT0201BRE0710KL)
R69  value 100k  [RESC0603X26X15NL03T05]  (hidden comment: CRG0201F100K)
R70  value 0  [FP-HCJ0201-IPC_C]  (hidden comment: HCJ0201ZT0R00)
R71  value 5.1k  [RESC0603X28X15ML05T05]  (hidden comment: CRCW02015K10JNED)
R72  value 100  [FP-RMCF0201-IPC_A]  (hidden comment: RMCF0201JT100R)
R73  value 5.1k  [RESC0603X28X15ML05T05]  (hidden comment: CRCW02015K10JNED)
R74  value 13k  [FP-RMCF0201-IPC_A]  (hidden comment: RMCF0201JT13K0)
R75  value 2.2  [FP-RMCF0201-IPC_A]  (hidden comment: RMCF0201JT2R20)
R76  value 2.2  [FP-RMCF0201-IPC_A]  (hidden comment: RMCF0201JT2R20)
R77  value 0  [FP-HCJ0201-IPC_C]  (hidden comment: HCJ0201ZT0R00)
R78  value 0  [FP-HCJ0201-IPC_C]  (hidden comment: HCJ0201ZT0R00)
R79  value 0  [FP-HCJ0201-IPC_C]  (hidden comment: HCJ0201ZT0R00)
SW1  EVQ-Q2H03W  [FP-EVQ-Q2H03W-MFG]
SW2  EVQ-Q2H03W  [FP-EVQ-Q2H03W-MFG]
SW3  B3FS-1012P  [FP-B3FS-1012P-MFG]
SW4  JS203011AQN  [FP-JS203011AQN-MFG]
U1  Amlogic A311D2  [BGA1058C40P33X37_1430X1610X110]  (parts A,B,C,D,E,F,G,H,I,J,K,L,M,N,O,P,Q,R,S,T,U of 21)
U2  PCF8563T/5,518  [FP-SOT96-1-MFG]
U3  STM32G031K6U6  [UFQFPN-32]
U4  MT53D1024M32D4DT-046_AIT_D  [BGA200C65P12X22_1000X1450X95]  (parts A,B of 2)
U5  KLMAG2GEND-B031  [BGA153N50P14X14_1150X1300X80N]
U6  TPS2115ADRBR  [FP-DRB0008B-IPC_B]
U7  TPS2121RUXR  [FP-RUX0012A-MFG]
U8  WS2812B-B  [LED_WS2812B-B]
U9  WS2812B-B  [LED_WS2812B-B]
U10  WS2812B-B  [LED_WS2812B-B]
U11  WS2812B-B  [LED_WS2812B-B]
U12  MAX98357AETE+T  [QFN50P300X300X80-17N]
U13  WS2812B-B  [LED_WS2812B-B]
U14  WS2812B-B  [LED_WS2812B-B]
U15  IM67D120AXTSA1  [FP-PG-LLGA-5-MFG]
U16  IM67D120AXTSA1  [FP-PG-LLGA-5-MFG]
U17  WS2812B-B  [LED_WS2812B-B]
U18  WS2812B-B  [LED_WS2812B-B]
U19  WS2812B-B  [LED_WS2812B-B]
U20  WS2812B-B  [LED_WS2812B-B]
U21  WS2812B-B  [LED_WS2812B-B]
U22  WS2812B-B  [LED_WS2812B-B]
U23  WS2812B-B  [LED_WS2812B-B]
U24  WS2812B-B  [LED_WS2812B-B]
U25  WS2812B-B  [LED_WS2812B-B]
U26  WS2812B-B  [LED_WS2812B-B]
X1  ABM3B-24.000MHZ-B2-T  [ABRA-ABM3B-4_V]
Y1  ABS06-127-32.768KHZ-T  [FP-ABS06-MFG]
Y2  ABM13W-37.4000MHZ-5-K1Z-T5  [FP-ABM13W-MFG]